# Altium schematic sheet MC_stm32.SchDoc
size 420 x 297 mm; SheetNumber: 3; SheetTotal: 3
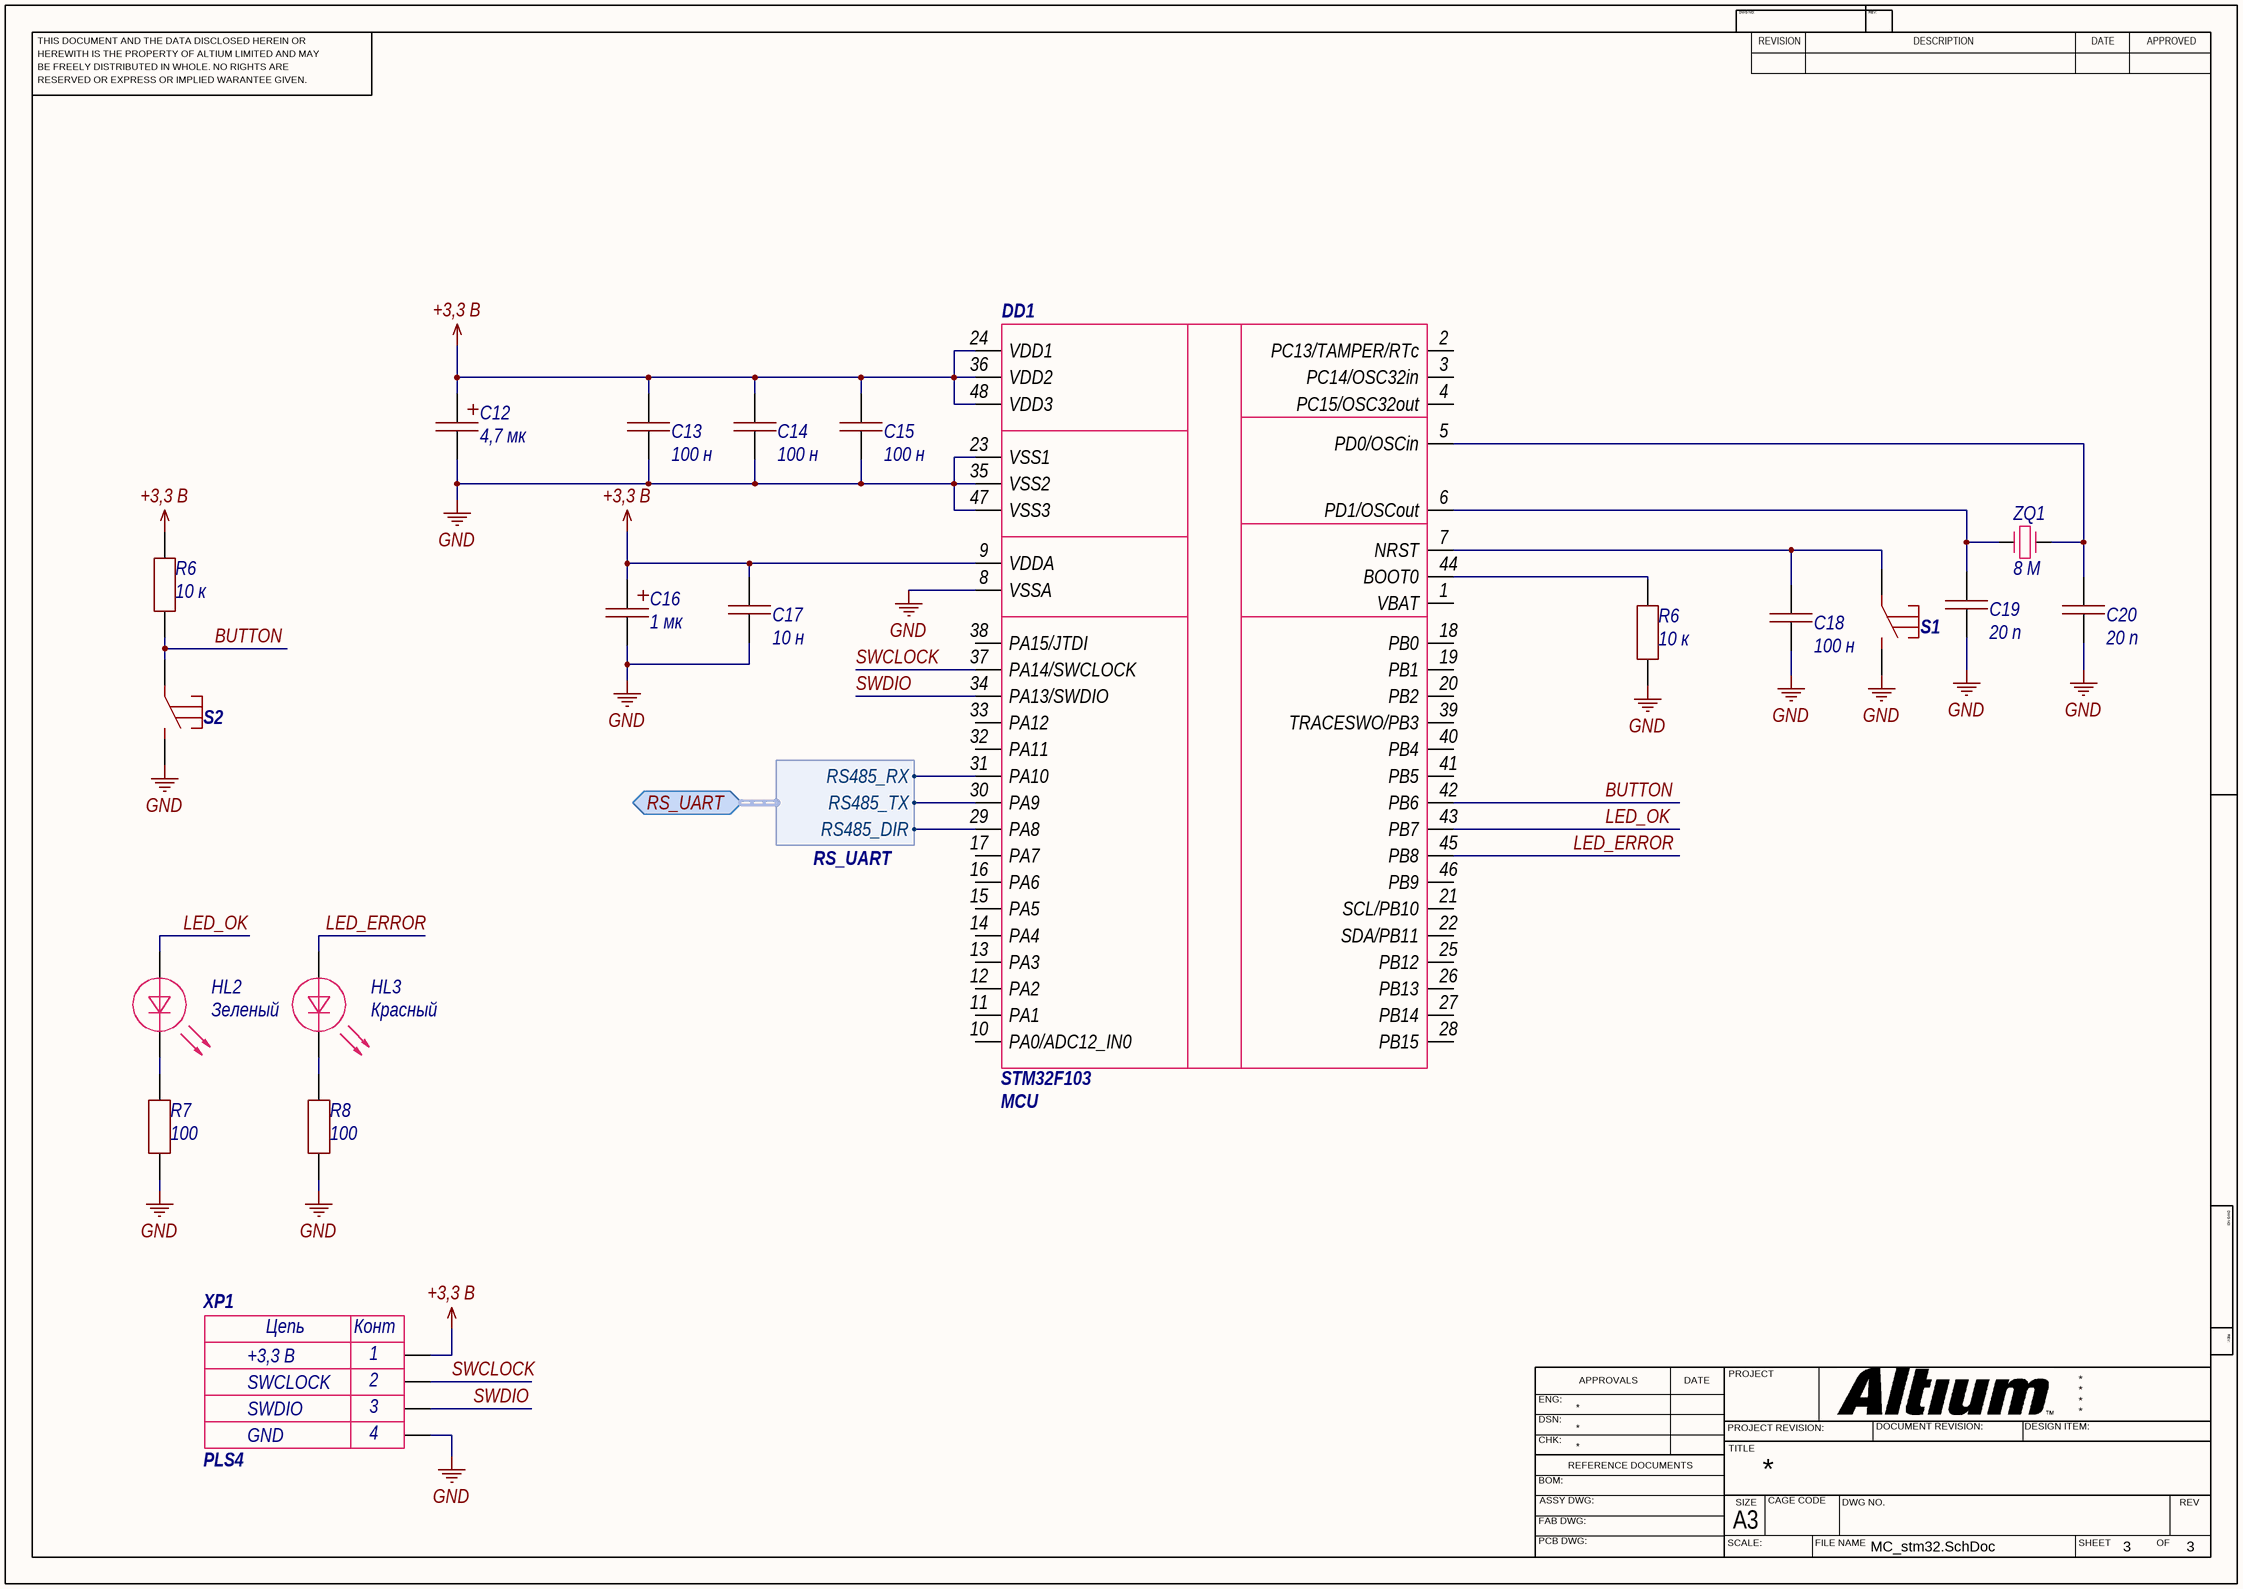
[diagram p0: MC_stm32.SchDoc]

## Parts
(Parts that share a designator on the sheet are numbered #1, #2 ... from top to bottom, then left to right.)
C13  value 100 н  [0603C]  (hidden comment: Конденсатор)
C14  value 100 н  [0603C]  (hidden comment: Конденсатор)
C15  value 100 н  [0603C]  (hidden comment: Конденсатор)
C16  value 1 мк  [TC_A (3216)]  (hidden comment: Конденсатор полевой)
C17  value 10 н  [0603C]  (hidden comment: Конденсатор)
C19  value 20 п  [0603C]  (hidden comment: Конденсатор)
C20  value 20 п  [0603C]  (hidden comment: Конденсатор)
DD1  STM32F103  Value1: MCU  [LQFP48]
HL2  Color: Зеленый  [0805D]
HL3  Color: Красный  [0805D]
R6#1  value 10 к  [0603R]  (hidden comment: Resistor)
R6#2  value 10 к  [0603R]  (hidden comment: Resistor)
R7  value 100  [0603R]  (hidden comment: Resistor)
R8  value 100  [0603R]  (hidden comment: Resistor)
S1  Tact button  [BUTTON_6x6]  (value not drawn)
S2  Tact button  [BUTTON_6x6]  (value not drawn)
XP1  Value3: SWDIO  Value2: SWCLOCK  Value4: GND  Value1: +3,3 В  [PLS4]  (hidden comment: PLS4)
ZQ1  value 8 М  [HC49SD]  (hidden comment: Кварцевый резонатор)
С12  value 4,7 мк  [TC_A (3216)]  (hidden comment: Конденсатор полевой)
С18  value 100 н  [0603C]  (hidden comment: Конденсатор)

## Ports
RS_UART (bidir, harness RS_UART)

## Harnesses
RS_UART: RS485_TX, RS485_DIR, RS485_RX

## Nets
+3,3 В: C13.1 C14.1 C15.1 C16.1 C17.2 DD1.9(VDDA) DD1.24(VDD1) DD1.36(VDD2) DD1.48(VDD3) R6#1.2 XP1.1 С12.1
GND: C13.2 C14.2 C15.2 C16.2 C17.1 C19.2 C20.2 DD1.8(VSSA) DD1.23(VSS1) DD1.35(VSS2) DD1.47(VSS3) R6#2.1 R7.2 R8.1 S1.2 S2.2 XP1.4 С12.2 С18.1
BUTTON: DD1.42(PB6) R6#1.1 S2.1
LED_ERROR: DD1.45(PB8) HL3.1
LED_OK: DD1.43(PB7) HL2.1
SWCLOCK: DD1.37(PA14/SWCLOCK) XP1.2
SWDIO: DD1.34(PA13/SWDIO) XP1.3
NetC19_1: C19.1 DD1.6(PD1/OSCout) ZQ1.1
NetC20_1: C20.1 DD1.5(PD0/OSCin) ZQ1.2
NetDD1_7: DD1.7(NRST) S1.1 С18.2
NetDD1_29: DD1.29(PA8) ; port RS_UART.RS485_DIR
NetDD1_30: DD1.30(PA9) ; port RS_UART.RS485_TX
NetDD1_31: DD1.31(PA10) ; port RS_UART.RS485_RX
NetDD1_44: DD1.44(BOOT0) R6#2.2
NetHL2_2: HL2.2 R7.1
NetHL3_2: HL3.2 R8.2

Not connected (* = marked no-connect by the designer): DD1 1(VBAT) 2(PC13/TAMPER/RTc) 3(PC14/OSC32in) 4(PC15/OSC32out) 10(PA0/ADC12_IN0) 11(PA1) 12(PA2) 13(PA3) 14(PA4) 15(PA5) 16(PA6) 17(PA7) 18(PB0) 19(PB1) 20(PB2) 21(SCL/PB10) 22(SDA/PB11) 25(PB12) 26(PB13) 27(PB14) 28(PB15) 32(PA11) 33(PA12) 38(PA15/JTDI) 39(TRACESWO/PB3) 40(PB4) 41(PB5) 46(PB9)

## Notes on the sheet
- THIS DOCUMENT AND THE DATA DISCLOSED HEREIN OR
- HEREWITH IS THE PROPERTY OF ALTIUM LIMITED AND MAY
- DWG NO:
- REVISION
- REV:
- DESCRIPTION
- DATE
- APPROVED
- BE FREELY DISTRIBUTED IN WHOLE. NO RIGHTS ARE
- RESERVED OR EXPRESS OR IMPLIED WARANTEE GIVEN.
- ENG:
- APPROVALS
- PROJECT
- DSN:
- CHK:
- REFERENCE DOCUMENTS
- PROJECT REVISION:
- TITLE
- DOCUMENT REVISION:
- DESIGN ITEM:
- BOM:
- FAB DWG:
- PCB DWG:
- ASSY DWG:
- SCALE:
- A3
- SIZE
- CAGE CODE
- FILE NAME
- DWG NO.
- SHEET
- OF
- REV
- (in symbol PLS4) Цепь; Конт

## Library data of the parts
C13-C15 = Capacitor: Конденсатор керамический SMD, 0603, 100 нФ
C16 = Capacitor_pol: Конденсатор электролит. танталовый, 1 мкФ, 3216
C17 = Capacitor: Конденсатор керамический SMD, 0603, 10 нФ
C19 C20 = Capacitor: Конденсатор керамический SMD, 30 пФ, 0603
DD1 = STM32F103_48pin: Микроконтроллер; Manufacturer: ST Microelectronics; Rate: -0,3...4,0В; Shop: магазин с самой дешевой ценой; Notice: 48 пиновая версия STM32F103; Datasheet: http://www.st.com/content/ccc/resource/technical/document/datasheet/33/d4/6f/1d/df/0b/4c/6d/CD00161566.pdf/files/CD00161566.pdf/jcr:content/translations/en.CD00161566.pdf; Case: корпус
HL2 HL3 = LED: Светодиод зеленый SMD 0805; Manufacturer: -; Rate: -; Datasheet: -; Shop: -; Notice: -; Case: -
R6#1 = Resistor: 0603 10 кОм, 1%, Чип резистор (SMD); Power: *
R6#2 = Resistor: 0603 100 кОм, 1%, Чип резистор (SMD); Power: *
R7 R8 = Resistor: 0.1Вт 0603 100 Ом, 1%, Чип резистор (SMD); Power: *
XP1 = PLS4: Manufacturer: Connfly; Notice: Вилка штырьевая 4 пина, шаг 2,54мм; Rate: 500В AC 1min; Datasheet: https://lib.chipdip.ru/227/DOC000227157.pdf; Shop: https://www.chipdip.ru/product/pls-4; Value: PLS4
ZQ1 = XTAL: 8.000 МГц HC-49SM, Кварцевый резонатор
С12 = Capacitor_pol: Конденсатор электролит. танталовый, 4,7 мкФ, 3216
С18 = Capacitor: Конденсатор керамический SMD, 0603, 0.1 uF